# EAGLE design JeeNodeJR_LIPO_v1.1 (EAGLE 5.10)
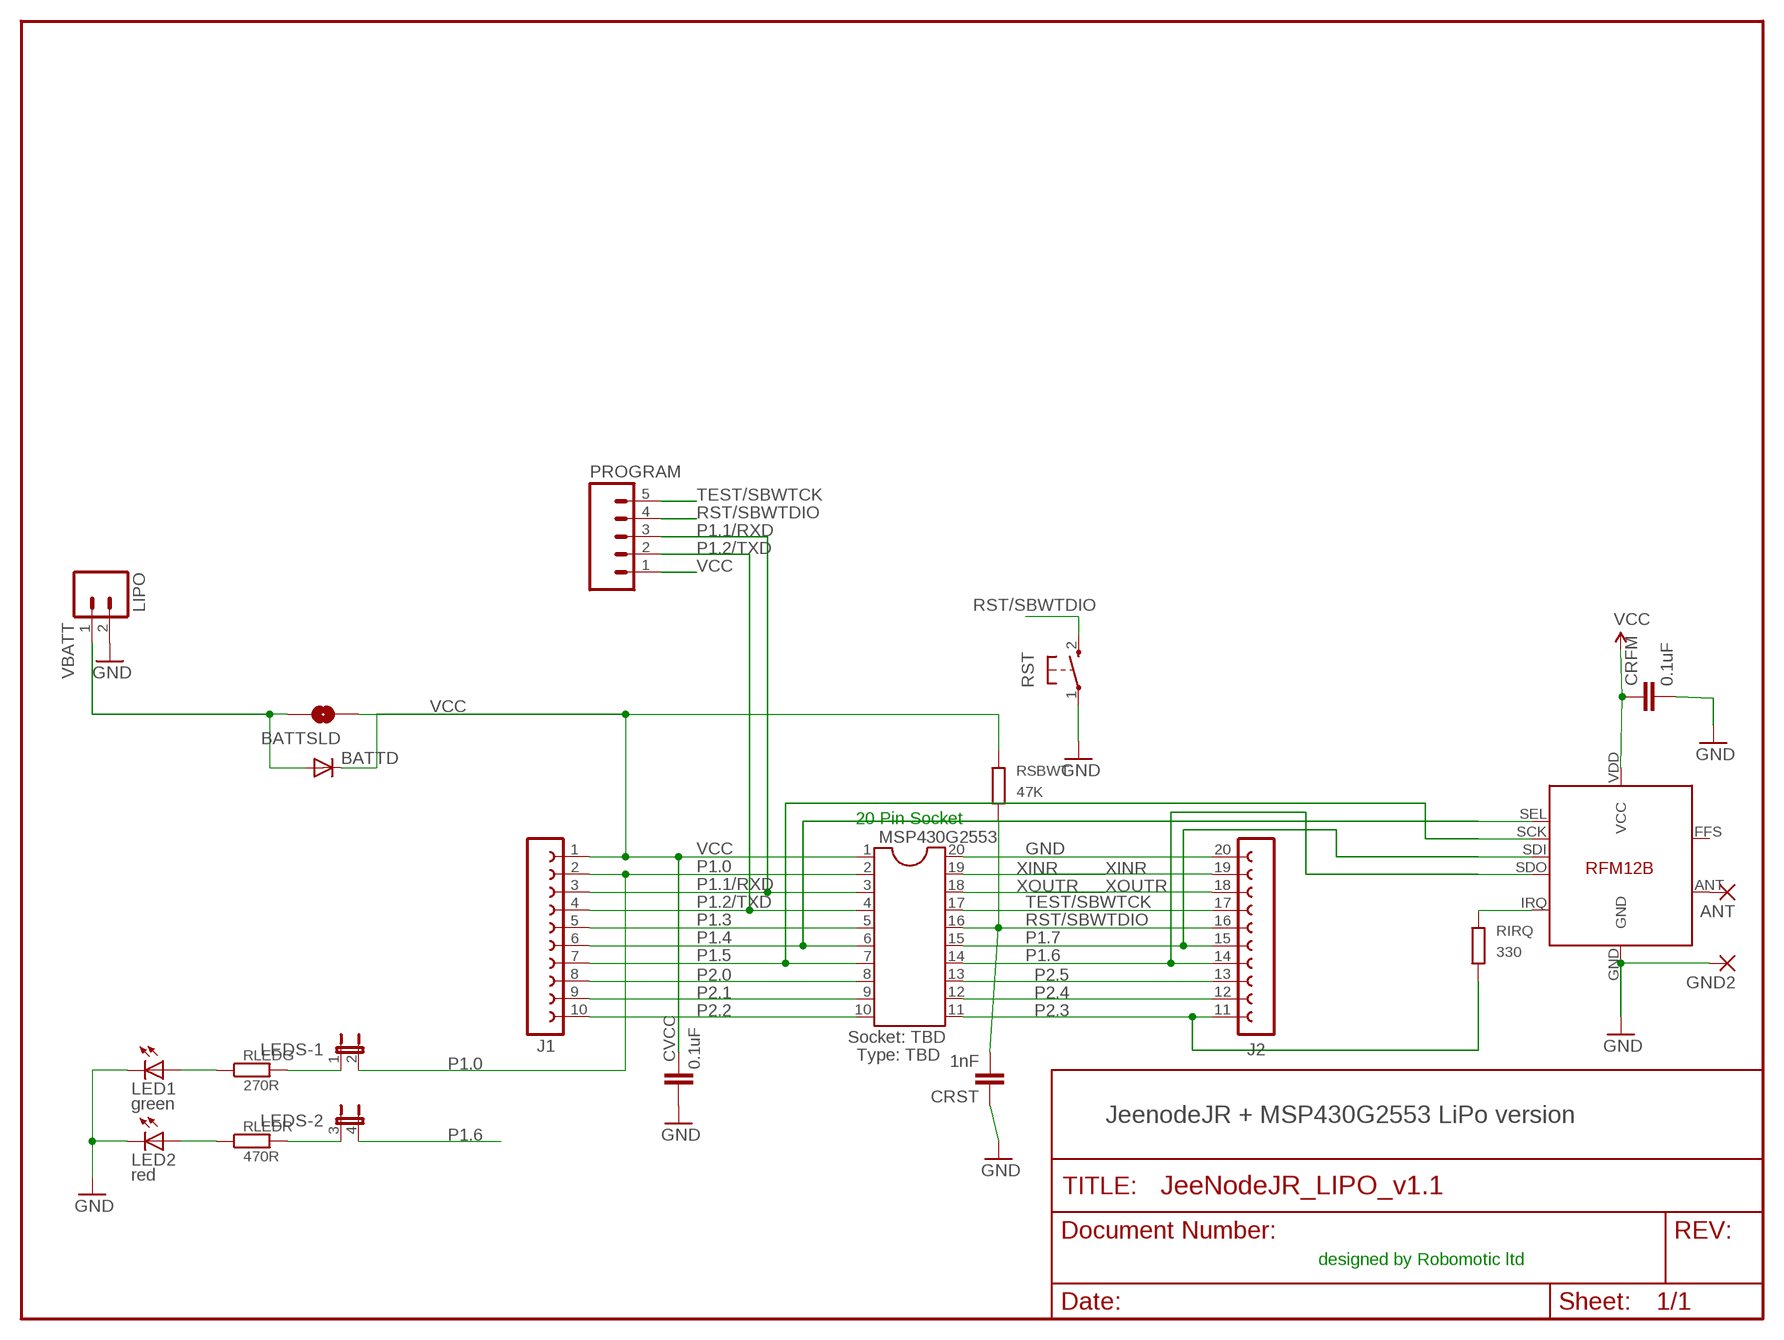
[diagram p0: schematic, sheet 1]

## Parts
868MHZ  RFM12B  [RFM12B]
ANT  1,6/0,8  [1,6/0,8]
BATTD  DIODE-D-5  [D-5]
BATTSLD  SOLDERJUMPERTRACE  [SJ_2S-TRACE]
CRFM  0.1uF  C-EU025-024X044  [C025-024X044]
CRST  1nF  C-EU025-024X044  [C025-024X044]
CVCC  0.1uF  C-EU025-024X044  [C025-024X044]
GND2  1,6/0,8  [1,6/0,8]
J1  FE10L  [FE10]
J2  FE10H  [FE10H]
LED1  green  LED3MM  [LED3MM]
LED2  red  LED3MM  [LED3MM]
LEDS  JP2QE  [JP2Q]
LIPO  M02PTH  [1X02]
MSP430G2553  DIL20  [DIL20]
PROGRAM  M05PTH  [1X05]
RIRQ  330  R-EU_0204/7  [0204/7]
RLEDG  270R  R-EU_0204/7  [0204/7]
RLEDR  470R  R-EU_0204/7  [0204/7]
RSBWT  47K  R-EU_0204/7  [0204/7]
RST  PB  [PBTH]

## Nets
GND [power]: 868MHZ.GND CRFM.2 CRST.1 CVCC.1 GND2.1(P) J2.20 LED1.K(C) LED2.K(C) LIPO.2 MSP430G2553.20 RST.1(P)
N$7: 868MHZ.IRQ RIRQ.1
N$13: 868MHZ.ANT ANT.1(P)
N$14: LED2.A RLEDR.1
N$15: LEDS.3 RLEDR.2
N$33: LEDS.1 RLEDG.2
N$34: LED1.A RLEDG.1
P1.0: J1.2 LEDS.2 MSP430G2553.2
P1.1/RXD: J1.3 MSP430G2553.3 PROGRAM.3
P1.2/TXD: J1.4 MSP430G2553.4 PROGRAM.2
P1.3: J1.5 MSP430G2553.5
P1.4: 868MHZ.SEL J1.6 MSP430G2553.6
P1.5: 868MHZ.SCK J1.7 MSP430G2553.7
P1.6: 868MHZ.SDO J2.14 LEDS.4 MSP430G2553.14
P1.7: 868MHZ.SDI J2.15 MSP430G2553.15
P2.0: J1.8 MSP430G2553.8
P2.1: J1.9 MSP430G2553.9
P2.2: J1.10 MSP430G2553.10
P2.3: J2.11 MSP430G2553.11 RIRQ.2
P2.4: J2.12 MSP430G2553.12
P2.5: J2.13 MSP430G2553.13
RST/SBWTDIO: CRST.2 J2.16 MSP430G2553.16 PROGRAM.4 RSBWT.2 RST.2(S)
TEST/SBWTCK: J2.17 MSP430G2553.17 PROGRAM.5
VBATT [power]: BATTD.A BATTSLD.2 LIPO.1
VCC: 868MHZ.VDD(VCC) BATTD.C BATTSLD.1 CRFM.1 CVCC.2 J1.1 MSP430G2553.1 PROGRAM.1 RSBWT.1
XINR: J2.19 MSP430G2553.19
XOUTR: J2.18 MSP430G2553.18
Unconnected: 868MHZ.FFS

## Notes on the sheet
- 20 Pin Socket
- Socket: TBD
- Type: TBD
- JeenodeJR + MSP430G2553 LiPo version
- designed by Robomotic ltd

## Library data of the parts
868MHZ = JeeLabs:RFM12B
ANT GND2 = JeeLabs:1,6/0,8: THROUGH-HOLE PAD
BATTD = diode:DIODE-: DIODE
BATTSLD = SparkFun:SOLDERJUMPER: Solder Jumper Standard SMD solder jumper. Used to automate production. Two varients : Normally Open and Normally Closed are the same, but have different paste layers. NC will have a large amount of paste and should jumper during reflow.
CRFM CRST CVCC = resistor:C-EU: CAPACITOR, European symbol
J1 = sMSP430:FE10L
J2 = sMSP430:FE10H
LED1 LED2 = SparkFun:LED: LEDs Standard schematic elements and footprints for 5mm, 3mm, 1206, and 0603 sized LEDs. 5mm - Spark Fun Electronics SKU : COM-00529 (and others)
LEDS = stexas:JP2QE: JUMPER
LIPO = SparkFun:M02: Header 2 Standard 2-pin 0.1" header. Use with straight break away headers (SKU : PRT-00116), right angle break away headers (PRT-00553), swiss pins (PRT-00743), machine pins (PRT-00117), and female headers (PRT-00115). Molex polarized connector foot print use with SKU : PRT-08233 with associated crimp pins and housings.
MSP430G2553 = ic-package:DIL20: Dual In Line / Socket
PROGRAM = SparkFun:M05: Header 5 Standard 5-pin 0.1" header. Use with straight break away headers (SKU : PRT-00116), right angle break away headers (PRT-00553), swiss pins (PRT-00743), machine pins (PRT-00117), and female headers (PRT-00115). Molex polarized connector foot print use with SKU : PRT-08230 with associated crimp pins and housings.
RIRQ RLEDG RLEDR RSBWT = resistor:R-EU_: RESISTOR, European symbol
RST = electricalmeter:PB: OMRON SWITCH

## Net classes
1 power: width 0.381 mm, clearance 0.254 mm

## Board
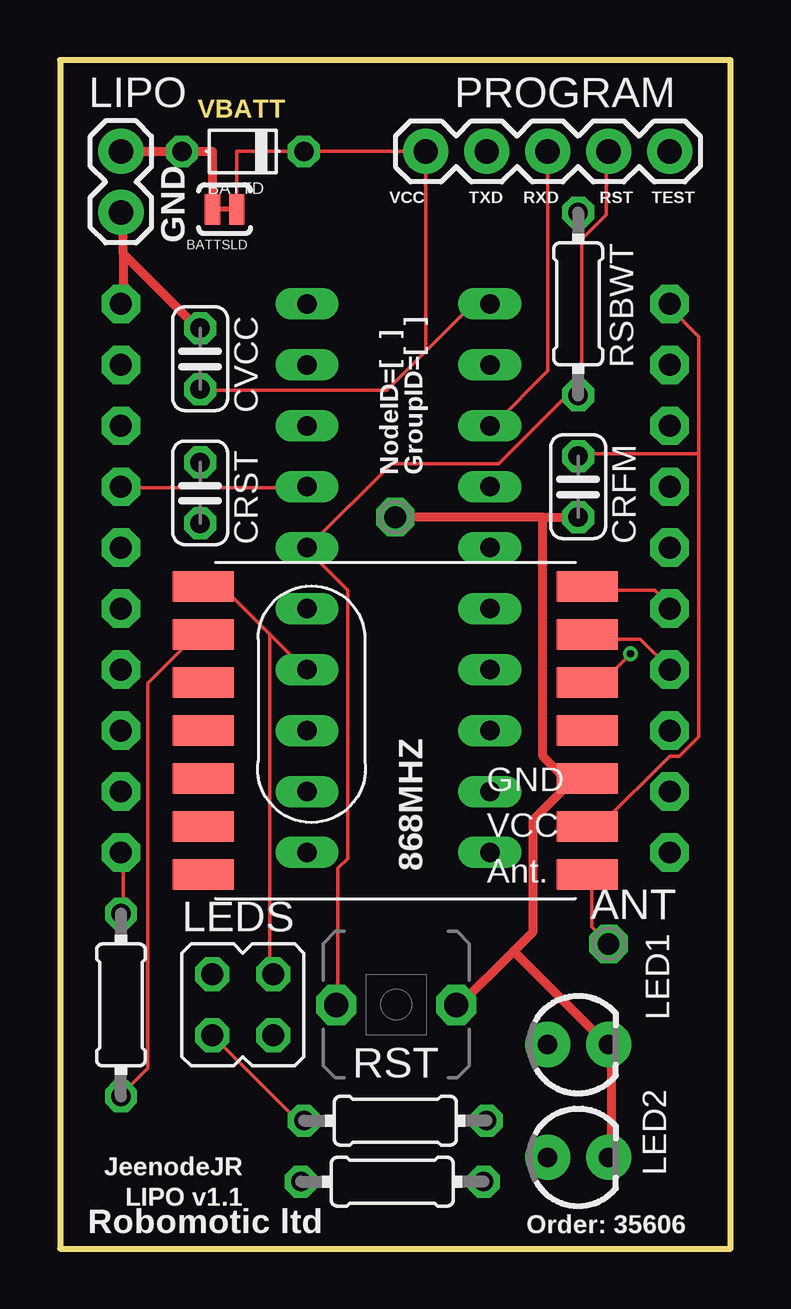
[diagram p1: board, top side]
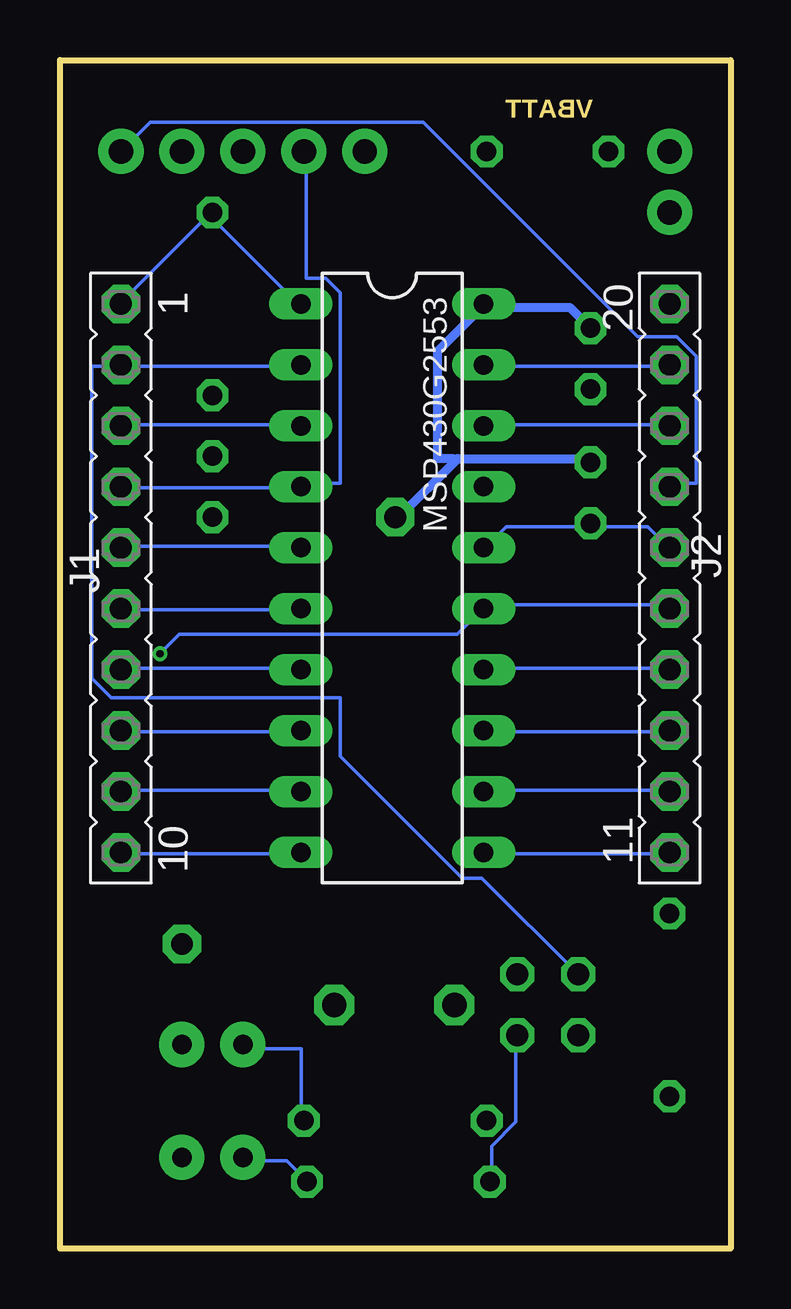
[diagram p2: board, bottom side, seen from below]

Size 27.94 x 49.53 mm. Coordinates in mm from the lower left corner, seen from the top.
Outline: 0,0 27.94,0 27.94,49.53 0,49.53 0,0
Copper layers (1*16): Top 0.035mm / dielectric 1.5mm / Bottom 0.035mm
Design rules "Fusion_eagle_rule_v1.1": minimum track width 6mil, minimum drill 12mil, track to track 6mil, track to pad 6mil, pad to pad 6mil, via to via 6mil, smd to smd 0mil, copper to edge 10mil, drill to drill 10mil, minimum pad ring 10mil, minimum via ring 6mil, stop-mask expansion 2mil, vias tented up to drill 100mil, thermal gap 10mil

### Footprints (pad centres in the part's own frame; a part is rotated, then mirrored left to right if it is on the bottom)
RFM12B = smd 2.54 x 1.27: ANT 8,-6; FFS -8,2; GND 8,-2; IRQ -8,4; P$8 -8,0; P$9 -8,-2; P$10 -8,-4; P$12 -8,-6; P$16 8,0; SCK 8,4; SDI 8,2; SDO -8,6; SEL 8,6; VDD 8,-4
1,6/0,8 = drill 0.9 pad 1.6 octagon: 1 0,0
D-5 = drill 0.813 octagon: A 2.54,0; C -2.54,0
SJ_2S-TRACE = smd 0.635 x 1.27: 1 -0.508,0; 2 0.508,0
C025-024X044 = drill 0.813 octagon: 1 -1.27,0; 2 1.27,0
FE10 = drill 0.914 pad 1.6 octagon: 1 -11.43,0; 2 -8.89,0; 3 -6.35,0; 4 -3.81,0; 5 -1.27,0; 6 1.27,0; 7 3.81,0; 8 6.35,0; 9 8.89,0; 10 11.43,0
FE10H = drill 0.914 pad 1.6 octagon: 11 -11.43,0; 12 -8.89,0; 13 -6.35,0; 14 -3.81,0; 15 -1.27,0; 16 1.27,0; 17 3.81,0; 18 6.35,0; 19 8.89,0; 20 11.43,0
LED3MM = drill 0.813 pad 1.88 round: A -1.27,0; K 1.27,0
JP2Q = drill 0.914 octagon: 1 -1.27,-1.27; 2 -1.27,1.27; 3 1.27,-1.27; 4 1.27,1.27
1X02 = drill 1.016 pad 1.88 round: 1 0,0; 2 2.54,0
DIL20 = drill 0.813 long: 1 -11.43,-3.81; 2 -8.89,-3.81; 3 -6.35,-3.81; 4 -3.81,-3.81; 5 -1.27,-3.81; 6 1.27,-3.81; 7 3.81,-3.81; 8 6.35,-3.81; 9 8.89,-3.81; 10 11.43,-3.81; 11 11.43,3.81; 12 8.89,3.81; 13 6.35,3.81; 14 3.81,3.81; 15 1.27,3.81; 16 -1.27,3.81; 17 -3.81,3.81; 18 -6.35,3.81; 19 -8.89,3.81; 20 -11.43,3.81
1X05 = drill 1.016 pad 1.88 round: 1 0,0; 2 2.54,0; 3 5.08,0; 4 7.62,0; 5 10.16,0
0204/7 = drill 0.813 octagon: 1 -3.81,0; 2 3.81,0
PBTH = drill 1.016 pad 1.676 octagon: 1 -0.001,0.001; 2 5.001,0.001

### Placement (x,y rotation side)
868MHZ  13.97,21.59 0 top
ANT  22.86,12.7 0 top
BATTD  7.62,45.72 180 top
BATTSLD  6.86,43.31 180 top
CRFM  21.59,31.75 270 top
CRST  5.84,31.5 270 top
CVCC  5.84,37.08 270 top
GND2  13.97,30.48 0 top
J1  25.4,27.94 270 bottom
J2  2.54,27.94 90 bottom
LED1  21.59,8.51 0 top
LED2  21.59,3.81 0 top
LEDS  7.62,10.16 0 top
LIPO  2.54,45.72 270 top
MSP430G2553  14.1,27.94 270 bottom
PROGRAM  15.24,45.72 0 top
RIRQ  2.54,10.16 90 top
RLEDG  13.97,5.33 180 top
RLEDR  13.84,2.79 180 top
RSBWT  21.59,39.37 270 top
RST  16.51,10.16 180 top

### Tracks (layer width: path | path; a pad name or v marks a point on that pad's centre or on a via)
GND
  Top 0.381: LED2.K 22.96,3.86 22.96,8.33 LED1.K 22.76,8.53 18.9,12.39 | 18.9,12.39 16.66,10.16 RST.1 | 18.9,12.39 19.71,13.21 19.71,17.88 21.34,19.51 21.95,19.51 868MHZ.GND 21.13,19.51 20.12,20.52 20.12,30.48 | 2.64,41.45 2.64,43.08 LIPO.2 | 2.64,41.45 2.64,39.42 J2.20 | 2.64,41.45 5.69,38.41 CVCC.1 | 20.12,30.48 CRFM.2 | 20.12,30.48 GND2.1
  Bottom 0.381: CVCC.1 6.71,39.22 10.16,39.22 MSP430G2553.20 10.36,39.22 12.19,37.39 12.19,32.92 11.58,32.92 11.48,32.82 | 11.48,32.82 13.82,30.48 GND2.1 | 11.48,32.82 11.38,32.92 5.89,32.92 CRST.1
N$7
  Top 0.152: 868MHZ.IRQ 5.89,25.4 5.49,25.4 3.66,23.57 3.66,7.52 2.64,6.5 RIRQ.1
N$13
  Top 0.152: 868MHZ.ANT 22.15,15.44 22.15,13.41 ANT.1
N$14
  Bottom 0.152: RLEDR.1 17.68,2.85 18.49,3.66 20.32,3.66 LED2.A
N$15
  Bottom 0.152: RLEDR.2 9.96,2.85 9.96,4.27 8.94,5.28 8.94,8.74 LEDS.3
N$33
  Top 0.152: RLEDG.2 10.16,5.49 9.75,5.49 LEDS.1
N$34
  Bottom 0.152: RLEDG.1 17.88,5.49 17.88,8.33 20.32,8.33 LED1.A
P1.0
  Bottom 0.152: 25.4,36.78 18.09,36.78 MSP430G2553.2 | 25.4,36.78 26.62,36.78 26.62,23.77 25.81,22.96 16.26,22.96 16.26,20.52 11.18,15.44 10.36,15.44 LEDS.2 | 25.4,36.78 J1.2
P1.1/RXD
  Top 0.152: PROGRAM.3 20.32,36.58 18.09,34.34 MSP430G2553.3
  Bottom 0.152: MSP430G2553.3 18.09,34.34 25.4,34.34 J1.3
P1.2/TXD
  Bottom 0.152: J1.4 25.4,31.7 18.09,31.7 MSP430G2553.4 17.88,31.9 16.26,31.9 16.26,39.83 16.87,40.44 17.68,40.44 17.68,45.72 PROGRAM.2
P1.3
  Bottom 0.152: MSP430G2553.5 18.09,29.26 25.4,29.26 J1.5
P1.4
  Top 0.152: 868MHZ.SEL 22.15,27.43 24.79,27.43 25.4,26.82 J1.6
  Bottom 0.152: MSP430G2553.6 18.09,26.62 25.4,26.62 J1.6
P1.5
  Top 0.152: 868MHZ.SCK 22.15,25.4 24.18,25.4 25.4,24.18 J1.7
  Bottom 0.152: MSP430G2553.7 18.09,24.18 25.4,24.18 J1.7
P1.6
  Top 0.152: 8.74,25.6 10.16,24.18 MSP430G2553.14 | 8.74,25.6 6.91,27.43 6.1,27.43 868MHZ.SDO | 8.74,25.6 8.74,11.58 LEDS.4
  Bottom 0.152: J2.14 2.64,24.18 10.16,24.18 MSP430G2553.14
P1.7  (via drill 0.3)
  Top 0.152: v23.77,24.79 22.76,23.77 22.15,23.77 868MHZ.SDI
  Bottom 0.152: v23.77,24.79 22.96,25.6 11.38,25.6 10.36,26.62 MSP430G2553.15 10.16,26.82 2.64,26.82 J2.15
P2.0
  Bottom 0.152: MSP430G2553.8 18.09,21.54 25.4,21.54 J1.8
P2.1
  Bottom 0.152: MSP430G2553.9 18.09,19.1 25.4,19.1 J1.9
P2.2
  Bottom 0.152: MSP430G2553.10 18.09,16.46 25.4,16.46 J1.10
P2.3
  Top 0.152: RIRQ.2 2.64,14.02 2.64,16.46 J2.11
  Bottom 0.152: MSP430G2553.11 10.16,16.46 2.64,16.46 J2.11
P2.4
  Bottom 0.152: MSP430G2553.12 10.16,19.1 2.64,19.1 J2.12
P2.5
  Bottom 0.152: MSP430G2553.13 10.16,21.54 2.64,21.54 J2.13
RST/SBWTDIO
  Top 0.152: PROGRAM.4 22.76,45.72 22.76,43.08 21.74,42.06 21.74,35.56 RSBWT.2 21.13,35.56 18.29,32.72 13.82,32.72 10.36,29.26 MSP430G2553.16 10.36,29.06 11.99,27.43 11.99,16.26 11.58,15.85 11.58,10.16 RST.2
  Bottom 0.152: MSP430G2553.16 10.16,29.26 9.35,30.07 5.89,30.07 CRST.2 5.69,30.07 3.45,30.07 2.64,29.26 J2.16
TEST/SBWTCK
  Top 0.152: MSP430G2553.17 10.16,31.7 2.64,31.7 J2.17
  Bottom 0.152: PROGRAM.5 24.18,46.94 12.8,46.94 3.86,38 2.23,38 1.42,37.19 1.42,31.9 2.44,31.9 J2.17
VBATT
  Top 0.381: LIPO.1 BATTD.A 6.35,45.72 BATTSLD.2
VCC
  Top 0.152: 15.24,37.39 17.07,39.22 17.88,39.22 MSP430G2553.1 | 15.24,37.39 13.61,35.76 5.89,35.76 CVCC.2 | 15.24,37.39 PROGRAM.1 BATTD.C 7.37,45.72 BATTSLD.1 | 26.62,33.12 26.62,38 25.4,39.22 J1.1 | 26.62,33.12 26.62,21.34 25.81,20.52 25.4,20.52 22.55,17.68 22.15,17.68 868MHZ.VDD | 26.62,33.12 21.74,33.12 CRFM.1
  Bottom 0.152: 21.74,43.08 25.4,39.42 J1.1 | 21.74,43.08 18.09,39.42 MSP430G2553.1 | 21.74,43.08 RSBWT.1
XINR
  Bottom 0.152: MSP430G2553.19 10.16,36.78 2.64,36.78 J2.19
XOUTR
  Bottom 0.152: MSP430G2553.18 10.16,34.34 2.64,34.34 J2.18

### Text on the board
Dimension: VBATT
tPlace: VCC | TXD | RXD | RST | TEST | JeenodeJR | LIPO v1.1 | Robomotic ltd
tNames: GND | NodeID=[ ] | GroupID=[ ] | Order: 35606